# Altium schematic sheet CurrentMeasurement.SchDoc
size A4
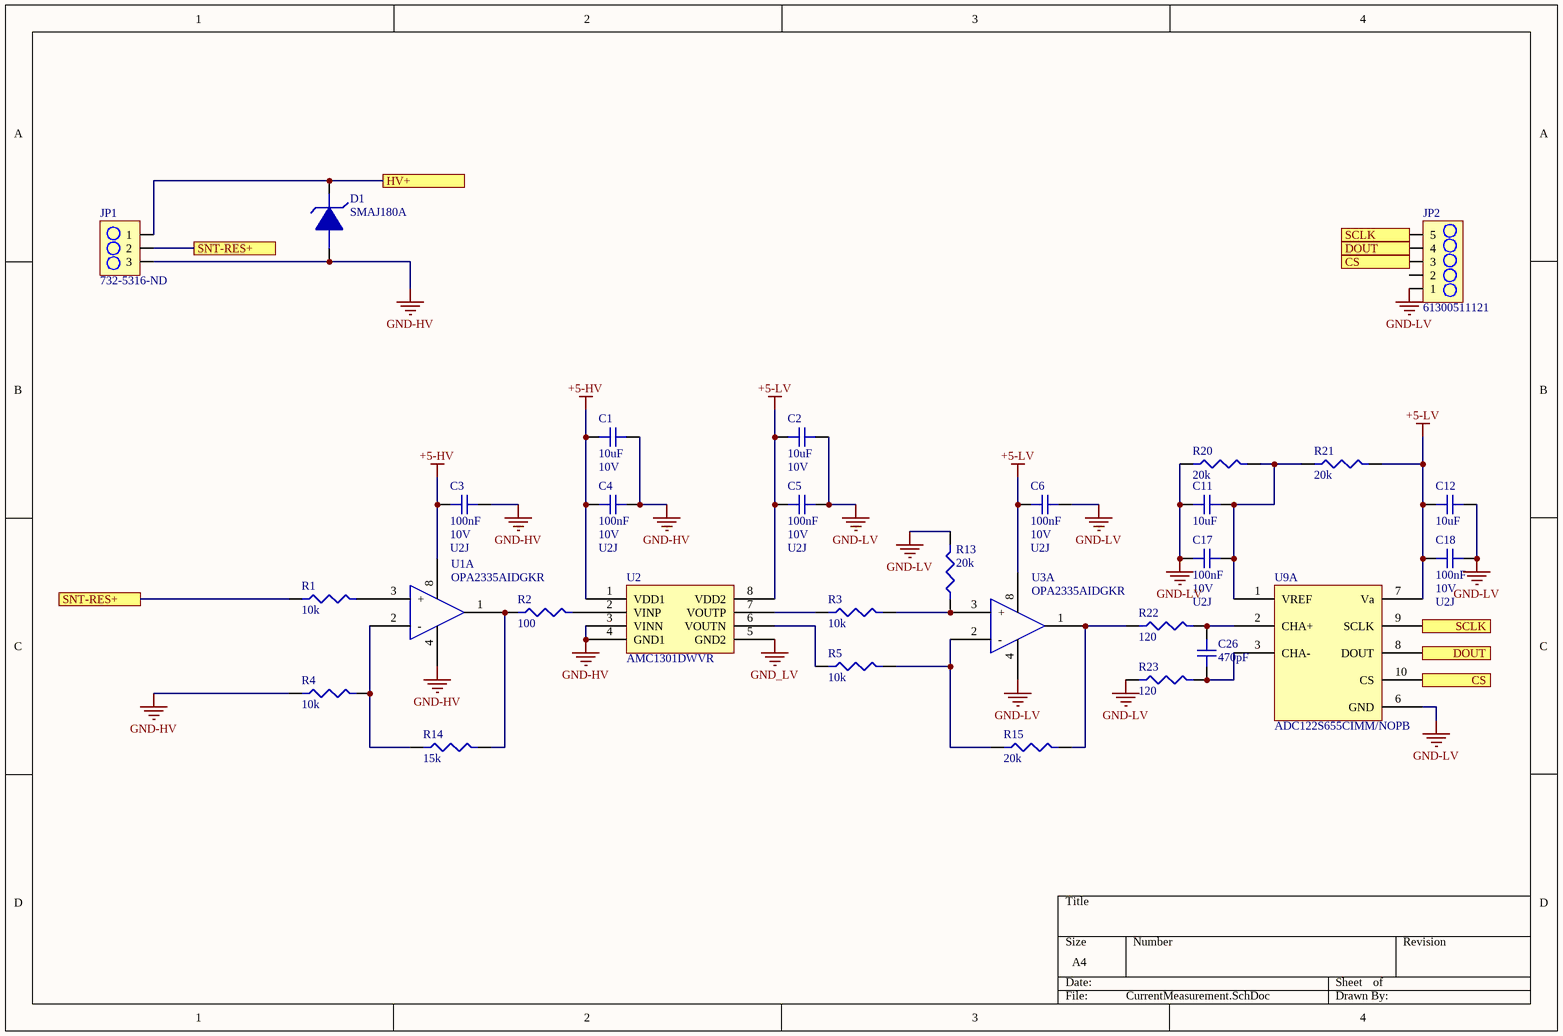
[diagram p0: CurrentMeasurement.SchDoc]

## Parts
C1  10uF  Voltage Rating: 10V  [TANT_10u]
C2  10uF  Voltage Rating: 10V  [TANT_10u]
C3  100nF  Voltage Rating: 10V  Dielectric: U2J  [C0805]
C4  100nF  Voltage Rating: 10V  Dielectric: U2J  [C0805]
C5  100nF  Voltage Rating: 10V  Dielectric: U2J  [C0805]
C6  100nF  Voltage Rating: 10V  Dielectric: U2J  [C0805]
C11  10uF  [C1206]
C12  10uF  [C1206]
C17  100nF  Voltage Rating: 10V  Dielectric: U2J  [C0805]
C18  100nF  Voltage Rating: 10V  Dielectric: U2J  [C0805]
C26  470pF  [C0805]
D1  SMAJ180A  [DIODE_TVS]
JP1  732-5316-ND  [3PIN_HEADER]
JP2  61300511121  [5PIN_HEADER]
R1  10k  [R0805]
R2  100  [R0805]
R3  10k  [R0805]
R4  10k  [R0805]
R5  10k  [R0805]
R13  20k  [R0805]
R14  15k  [R0805]
R15  20k  [R0805]
R20  20k  [R0805]
R21  20k  [R0805]
R22  120  [R0805]
R23  120  [R0805]
U1  OPA2335AIDGKR  [8-VSSOP-OPA2335AIDGKR]  (part A of 2)
U2  AMC1301DWVR  [8-SOIC-AMC1301DWVR]
U3  OPA2335AIDGKR  [8-VSSOP-OPA2335AIDGKR]  (part A of 2)
U9  ADC122S655CIMM/NOPB  [10-VSSOP-ADC122S655CIMM/NOPB]  (part A of 2)

## Ports
CS, DOUT, HV+, SCLK, SNT-RES+

## Nets
+5-HV: C1.1 C3.1 C4.1 U1.8(V+) U2.1(VDD1)
+5-LV: C2.1 C5.1 C6.1 C12.1 C18.1 R21.2 U2.8(VDD2) U3.8(V+) U9.7(Va)
GND-HV: C1.2 C3.2 C4.2 D1.2 JP1.3 R4.1 U1.4(V-) U2.3(VINN) U2.4(GND1)
GND-LV: C2.2 C5.2 C6.2 C11.1 C12.2 C17.1 C18.2 JP2.1 R13.2 R20.1 R23.1 U3.4(V-) U9.6(GND)
GND_LV: U2.5(GND2)
CS: JP2.3 U9.10(CS) ; port CS
DOUT: JP2.4 U9.8(DOUT) ; port DOUT
HV+: D1.1 JP1.1 ; port HV+
SCLK: JP2.5 U9.9(SCLK) ; port SCLK
SNT-RES+: JP1.2 R1.1 ; port SNT-RES+
NetC11_2: C11.2 C17.2 R20.2 R21.1 U9.1(VREF)
NetC26_1: C26.1 R23.2 U9.3(CHA-)
NetC26_2: C26.2 R22.2 U9.2(CHA+)
NetR1_2: R1.2 U1.3(+)
NetR2_1: R2.1 R14.2 U1.1(OutA)
NetR2_2: R2.2 U2.2(VINP)
NetR3_1: R3.1 U2.7(VOUTP)
NetR3_2: R3.2 R13.1 U3.3(+)
NetR4_2: R4.2 R14.1 U1.2(-)
NetR5_1: R5.1 U2.6(VOUTN)
NetR5_2: R5.2 R15.1 U3.2(-)
NetR15_2: R15.2 R22.1 U3.1(OutA)

Not connected (* = marked no-connect by the designer): JP2 2

## Library data of the parts
C1 C2 = F381A106MMA: CAP TANTALUM 10uF, 0603 [1608 Metric], 0.5 ohm, 10 V AVX  Surface Mount Tantalum Capacitor, F38 Series, 10uF, 0603 [1608 Metric], 0.5 ohm, 10 V; Manufacturer: Kyocera AVX; Tolerance: 20%; ESR (Equivalent Series Resistance): 500mR; Life (Hours): 1000Hour; Dissipation Factor: 15%; Leakage Current: 10uA; Supplier 1: Digi-Key; Manufacturer Part Number: F381A106MMA; Stock 1: 7989; Pricing 1: 1=0.75, 10=0.551, 100=0.3779, 500=0.2992, 1000=0.2519 (USD); Case/Package: 0603; Weight: 7.1E-05oz; Case Code (Metric): 1608; Case Code (Imperial): 0603; Min Operating Temperature: -55°C; Max Operating Temperature: 105°C; Capacitance: 10uF; Packaging: Tape and Reel; Termination: SMD/SMT; Package Quantity: 4000; Voltage Rating (DC): 10V; Length: 1.6mm; Height: 0.8mm; Width: 0.033inch; Height - Seated (Max): 0.035inch; Depth: 0.85mm; Radiation Hardening: No; REACH SVHC: No SVHC; ComponentLink1URL: https://datasheet.ciiva.com/48510/f38-48510901.pdf; ComponentLink1Description: https://datasheet.ciiva.com/48510/f38-48510901.pdf; ComponentLink2URL: https://datasheet.ciiva.com/46417/1805432-46417517.pdf; ComponentLink2Description: https://datasheet.ciiva.com/46417/1805432-46417517.pdf; ComponentLink3URL: https://datasheet.ciiva.com/46417/1805432-46417518.pdf; ComponentLink3Description: https://datasheet.ciiva.com/46417/1805432-46417518.pdf; Supplier Part Number 1: 478-9527-1-ND
C3-C6 C17 C18 = GRM21B7U1A104JA01L: CAP MLCC 100nF 10Volts U2J 5%; Manufacturer: Murata; Supplier 1: Digi-Key; Manufacturer Part Number: GRM21B7U1A104JA01L; Stock 1: 6000; Pricing 1: 1=0.46, 10=0.32, 100=0.192, 500=0.144, 1000=0.1216 (USD); Mount: Surface Mount; Case/Package: 0805; Case Code (Imperial): 0805; Case Code (Metric): 2012; Min Operating Temperature: -55°C; Max Operating Temperature: 125°C; Capacitance: 100nF; Voltage Rating (DC): 10V; Tolerance: 5%; Packaging: Tape and Reel; Package Quantity: 3000; Termination: SMD/SMT; Length: 2mm; Height: 1.25mm; Width: 0.049inch; Thickness: 0.053inch; Depth: 1.25mm; Radiation Hardening: No; ComponentLink1URL: https://datasheet.ciiva.com/5424/product-5424660.pdf; ComponentLink1Description: https://datasheet.ciiva.com/5424/product-5424660.pdf; ComponentLink2URL: https://datasheet.ciiva.com/17451/product-17451845.pdf; ComponentLink2Description: https://datasheet.ciiva.com/17451/product-17451845.pdf; ComponentLink3URL: https://datasheet.ciiva.com/11618/product-11618924.pdf; ComponentLink3Description: https://datasheet.ciiva.com/11618/product-11618924.pdf; Supplier Part Number 1: 490-11592-6-ND
C11 C12 = GCJ31CR71A106KA13L: CAP 10µF ±10% 10V Ceramic Capacitor X7R 1206 (3216 Metric); Manufacturer: Murata; Manufacturer Part Number: GCJ31CR71A106KA13L; Mount: Surface Mount; Case/Package: 1206; Case Code (Metric): 3216; Min Operating Temperature: -55°C; Max Operating Temperature: 125°C; Capacitance: 10uF; Tolerance: 10%; Packaging: Tape and Reel; Package Quantity: 2000; Length: 3.2mm; Height: 1.8mm; Width: 0.063 inch; Thickness: 0.071 inch; Radiation Hardening: No; Voltage Rating: 10V; Supplier 1: Digi-Key; ComponentLink1Description: https://www.murata.com/~/media/webrenewal/support/library/catalog/products/capacitor/mlcc/c03e.ashx?la=en-us; ComponentLink1URL: https://www.murata.com/~/media/webrenewal/support/library/catalog/products/capacitor/mlcc/c03e.ashx?la=en-us; Supplier Part Number 1: 490-5848-2-ND
C26 = GRM21A7U2E471JW31D: CAP  470pF ±5% 250V Ceramic Capacitor U2J 0805 (2012 Metric); Manufacturer: Murata; Manufacturer Part Number: GRM21A7U2E471JW31D; Mount: Surface Mount; Case/Package: 0805; Case Code (Metric): 2012; Min Operating Temperature: -55°C; Max Operating Temperature: 125°C; Capacitance: 470pF; Tolerance: 5%; Packaging: Tape and Reel; Package Quantity: 2000; Length: 2mm; Height: 1.25mm; Width: 0.063 inch; Thickness: 0.071 inch; Radiation Hardening: No; Voltage Rating: 250V; Supplier 1: Digi-Key; Supplier Part Number 1: 490-6460-2-ND
D1 = SMAJ180A: TVS diode 180V, 292V Clamp 1.4A Ipp Tvs Diode Surface Mount DO-214AC (SMA); Manufacturer: MCC; Voltage - Reverse standoff: 180; Type: Zener; Power peak pulse: 400W; Voltage breakdown: 201V; Manufacturer Part Number: SMAJ180A; Mount: Surface Mount; Current peak Pulse: 1.4A; Packaging: Tape and Reel; Voltage Clamping: 292V; Lead Free: Lead Free; Supplier 1: Digi-Key; ComponentLink1Description: https://www.littelfuse.com/~/media/electronics/datasheets/tvs_diodes/littelfuse_tvs_diode_smaj_datasheet.pdf.pdf; ComponentLink1URL: https://www.littelfuse.com/~/media/electronics/datasheets/tvs_diodes/littelfuse_tvs_diode_smaj_datasheet.pdf.pdf; Supplier Part Number 1: SMAJ180ALFTR-ND
JP1 = 61300311121: CONN_HeaderPins3pos WURTH ELEKTRONIK Board-To-Board Connector, Vertical, WR-PHD Series, Through Hole, Header, 3 Contacts, 2.54 mm; Manufacturer: Wurth Electronics; Number of Positions: 3; Gender: Male; Connector Type: Male Pin; Pitch: 0.1inch; Supplier 1: Digi-Key; Manufacturer Part Number: 61300311121; Stock 1: 57026; Pricing 1: 1=0.13, 10=0.106, 25=0.088, 50=0.074, 100=0.067, 1000=0.061 (USD); Mount: Through Hole; Case/Package: 100; Contact Plating: Gold; Contact Material: Copper; Colour: Black; Number of Rows: 1; Packaging: Bulk; Termination: Solder; Number of Contacts: 3; Contact Mating Length: 0.236inch; REACH SVHC: Unknown; Lead Free: Lead Free; ComponentLink1URL: http://www.farnell.com/cad/1737268.pdf; ComponentLink1Description: http://www.farnell.com/cad/1737268.pdf; Supplier Part Number 1: 732-5316-ND
JP2 = 61300511121: CONN_HeaderPins5pos WURTH ELEKTRONIK         61300511121            Board-To-Board Connector, Vertical, WR-PHD Series, Through Hole, Header, 5 Contacts, 2.54 mm; Manufacturer: Wurth Electronics; Number of Positions: 5; Gender: Male; Connector Type: Male Pin; Pitch: 0.1inch; Supplier 1: Digi-Key; Manufacturer Part Number: 61300511121; Stock 1: 13004; Pricing 1: 1=0.25, 10=0.209, 25=0.174, 50=0.145, 100=0.132, 1000=0.12 (USD); Mount: Through Hole; Contact Plating: Gold; Contact Material: Copper; Colour: Black; Number of Rows: 1; Packaging: Bulk; Termination: Solder; Number of Contacts: 5; Contact Mating Length: 0.236inch; REACH SVHC: Unknown; Lead Free: Lead Free; ComponentLink1URL: http://www.farnell.com/cad/1737268.pdf; ComponentLink1Description: http://www.farnell.com/cad/1737268.pdf; Supplier Part Number 1: 732-5318-ND
R1 R3-R5 = RC0805FR-071KL: RES SMD 10K OHM 1% 1/8W 0805; Manufacturer: Yageo Phycomp; Temperature Coefficient: 100ppm/°C; Resistance: 1KR; Voltage Rating (DC): 150V; Power Rating: 125mW; Supplier 1: Digi-Key; Manufacturer Part Number: RC0805FR-071KL; Stock 1: 5527973; Pricing 1: 1=0.1, 10=0.022, 100=0.0088, 1000=0.004, 2500=0.0034 (USD); Case/Package: 0805; Number of Pins: 2; Min Operating Temperature: -55°C; Max Operating Temperature: 155°C; Tolerance: 1%; Packaging: Cut Tape; Length: 2mm; Height: 0.5mm; Width: 1.25mm; Depth: 1.25mm; REACH SVHC: No SVHC; Lead Free: Lead Free
R2 = ERA-6AEB101V: RES SMD 100 OHM 0805 100 Ohm 0.1% 0.125W(1/8W) ±25ppm/C Molded SMD Automotive Punched T/R; Manufacturer: Panasonic ECG; Manufacturer Part Number: ERA-6AEB102V; Voltage Rating: 100V; Resistance: 100R; Power Rating: 125mW; Temperature Coefficient: 25ppm/°C; Mount: Surface Mount; Case/Package: 0805; Number of Pins: 2; Case Code (Metric): 2012; Case Code (Imperial): 0805; Contact Plating: Tin; Min Operating Temperature: -55°C; Max Operating Temperature: 155°C; Packaging: Tape and Reel; Tolerance: 0.1%; Package Quantity: 5000; Composition: Thin Film; Number of Terminations: 2; Military Standard: Not; Termination: SMD/SMT; Max Power Dissipation: 125mW; Length: 2mm; Height: 0.5mm; Width: 1.25mm; Depth: 1.25mm; Radiation Hardening: No; REACH SVHC: No SVHC; ComponentLink1Description: https://industrial.panasonic.com/cdbs/www-data/pdf/RDM0000/AOA0000C307.pdf; ComponentLink1URL: https://industrial.panasonic.com/cdbs/www-data/pdf/RDM0000/AOA0000C307.pdf; Supplier 1: Digi-Key; Supplier Part Number 1: P100DATR-ND
R13 R15 R20 R21 = ERA-6AEB203V: RES SMD 20K OHM 0805 20K Ohm 0.1% 0.125W(1/8W) ±25ppm/C Molded SMD Automotive Punched T/R; Manufacturer: Panasonic ECG; Manufacturer Part Number: ERA-6AEB102V; Voltage Rating: 100V; Resistance: 20kR; Power Rating: 125mW; Temperature Coefficient: 25ppm/°C; Mount: Surface Mount; Case/Package: 0805; Number of Pins: 2; Case Code (Metric): 2012; Case Code (Imperial): 0805; Contact Plating: Tin; Min Operating Temperature: -55°C; Max Operating Temperature: 155°C; Packaging: Tape and Reel; Tolerance: 0.1%; Package Quantity: 5000; Composition: Thin Film; Number of Terminations: 2; Military Standard: Not; Termination: SMD/SMT; Max Power Dissipation: 125mW; Length: 2mm; Height: 0.5mm; Width: 1.25mm; Depth: 1.25mm; Radiation Hardening: No; REACH SVHC: No SVHC; ComponentLink1Description: https://industrial.panasonic.com/cdbs/www-data/pdf/RDM0000/AOA0000C307.pdf; ComponentLink1URL: https://industrial.panasonic.com/cdbs/www-data/pdf/RDM0000/AOA0000C307.pdf; Supplier 1: Digi-Key; Supplier Part Number 1: P20KDATR-ND
R14 = ERA-6AEB153V: RES SMD 15K OHM 0805 15K Ohm 0.1% 0.125W(1/8W) ±25ppm/C Molded SMD Automotive Punched T/R; Manufacturer: Panasonic ECG; Manufacturer Part Number: ERA-6AEB102V; Voltage Rating: 100V; Resistance: 15kR; Power Rating: 125mW; Temperature Coefficient: 25ppm/°C; Mount: Surface Mount; Case/Package: 0805; Number of Pins: 2; Case Code (Metric): 2012; Case Code (Imperial): 0805; Contact Plating: Tin; Min Operating Temperature: -55°C; Max Operating Temperature: 155°C; Packaging: Tape and Reel; Tolerance: 0.1%; Package Quantity: 5000; Composition: Thin Film; Number of Terminations: 2; Military Standard: Not; Termination: SMD/SMT; Max Power Dissipation: 125mW; Length: 2mm; Height: 0.5mm; Width: 1.25mm; Depth: 1.25mm; Radiation Hardening: No; REACH SVHC: No SVHC; Supplier 1: Digi-Key; ComponentLink1Description: https://industrial.panasonic.com/cdbs/www-data/pdf/RDM0000/AOA0000C307.pdf; ComponentLink1URL: https://industrial.panasonic.com/cdbs/www-data/pdf/RDM0000/AOA0000C307.pdf; Supplier Part Number 1: P15KDATR-ND
R22 R23 = RC0805FR-07120RL: RES SMD 120 OHM 1% 1/8W 0805; Manufacturer: Yageo; Resistance: 120R; Power Rating: 125mW; Voltage Rating: 150V; Temperature Coefficient: 100ppm/°C; Supplier 1: Digi-Key; Manufacturer Part Number: RC0805FR-07120RL; Stock 1: 632664; Pricing 1: 1=0.1, 10=0.022, 100=0.0088, 1000=0.004, 2500=0.0034 (USD); Case/Package: 0805; Case Code (Metric): 2012; Case Code (Imperial): 0805; Min Operating Temperature: -55°C; Max Operating Temperature: 155°C; Tolerance: 1%; Package Quantity: 1; Packaging: Tape and Reel; Composition: Thick Film; Number of Terminations: 2; Termination: SMD/SMT; Military Standard: Not; Max Power Dissipation: 125mW; Length: 2mm; Height: 0.5mm; Width: 0.049inch; Depth: 1.25mm; REACH SVHC: Unknown; Lead Free: Lead Free; ComponentLink1URL: https://datasheet.ciiva.com/2491/pyu-r-int-thick-7-2491585.pdf; ComponentLink1Description: https://datasheet.ciiva.com/2491/pyu-r-int-thick-7-2491585.pdf; ComponentLink2URL: https://datasheet.ciiva.com/2491/pyu-r-int-thick-7-2491586.pdf; ComponentLink2Description: https://datasheet.ciiva.com/2491/pyu-r-int-thick-7-2491586.pdf; ComponentLink3URL: https://datasheet.ciiva.com/2491/pyu-r-int-thick-7-2491587.pdf; ComponentLink3Description: https://datasheet.ciiva.com/2491/pyu-r-int-thick-7-2491587.pdf; ComponentLink4URL: https://datasheet.ciiva.com/12558/rc0805-257173-12558661.pdf; ComponentLink4Description: https://datasheet.ciiva.com/12558/rc0805-257173-12558661.pdf; ComponentLink5URL: https://datasheet.ciiva.com/11819/0900766b8106beab-11819786.pdf; ComponentLink5Description: https://datasheet.ciiva.com/11819/0900766b8106beab-11819786.pdf; ComponentLink6URL: https://datasheet.ciiva.com/7941/444164-7941691.pdf; ComponentLink6Description: https://datasheet.ciiva.com/7941/444164-7941691.pdf; ComponentLink7URL: https://datasheet.ciiva.com/7941/444164-7941692.pdf; ComponentLink7Description: https://datasheet.ciiva.com/7941/444164-7941692.pdf; ComponentLink8URL: https://datasheet.ciiva.com/16964/rc0805-16964606.pdf; ComponentLink8Description: https://datasheet.ciiva.com/16964/rc0805-16964606.pdf; Supplier Part Number 1: 311-120CRCT-ND
U1 U3 = OPA2335AIDGKR: IC OPAMP ZERO-DRIFT 2CIRC 8VSSOP; Manufacturer: Texas Instruments; Gain Bandwidth Product: 2MHz; Current - Input Bias: 70 pA; Current - Supply: 570 uA; Current - Output: 50 mA; Voltage Supply: 2.7-5.5V, +/-1.35 - 2.75; Voltage - Input Offset: 1 uV; Slew Rate: 1.6V/us; Output Type: Rail-to-Rail; Manufacturer Part Number: OPA2335AIDGKR; Case/Package: 8-TSSOP; Amplifier Type: Zero-Drift; Operating Temperature: -40C - 125C; Mounting: Surface Mount; ComponentLink1Description: http://www.ti.com/general/docs/suppproductinfo.tsp?distId=10&gotoUrl=http%3A%2F%2Fwww.ti.com%2Flit%2Fgpn%2Fopa334; ComponentLink1URL: http://www.ti.com/general/docs/suppproductinfo.tsp?distId=10&gotoUrl=http%3A%2F%2Fwww.ti.com%2Flit%2Fgpn%2Fopa334; Supplier 1: Digi-Key; Supplier Part Number 1: 296-41350-1-ND
U2 = AMC1301DWVR: IC OPAMP ISOLATION 1 CIRC 8 SOIC; Manufacturer: Texas Instruments; Gain Bandwidth Product: 1MHz; Current - Input Bias: 60 uA; Current - Supply: 5.9 mA; Current - Output: 13 mA; Voltage Supply: 3v - 5.5V; Voltage - Input Offset: 50 uV; Manufacturer Part Number: AMC1301DWVR; Case/Package: 8-SOIC; ComponentLink1Description: http://www.ti.com/general/docs/suppproductinfo.tsp?distId=10&gotoUrl=http%3A%2F%2Fwww.ti.com%2Flit%2Fgpn%2Famc1301; ComponentLink1URL: http://www.ti.com/general/docs/suppproductinfo.tsp?distId=10&gotoUrl=http%3A%2F%2Fwww.ti.com%2Flit%2Fgpn%2Famc1301; Supplier 1: Digi-Key; Supplier Part Number 1: 296-44577-1-ND; Amplifier Type: Isolation; Operating Temperature: -40C - 125C; Mounting: Surface Mount
U9 = ADC122S655CIMM/NOPB: 12 Bit Analog to Digital Converter 2 Input 2 SAR 10-VSSOP; Manufacturer: Texas Instruments; Sampleing Rate: 500k; Ratio: 1:1; Number of Inputs: 2; Configuration: S/H-ADC; Number of Bits: 12; Data Interface: SPI, DSP; Input type: Differential, Single Ended; Operation temp: -40C-105C; Voltage Supply Digital: 5V; Reference Type: External; Manufacturer Part Number: ADC122S655CIMM/NOPB; Number of A/D Converters: 2; Architecture: SAR; Mounting: Surface Mount; Package: 10-VSSOP; ComponentLink1Description: http://www.ti.com/general/docs/suppproductinfo.tsp?distId=10&gotoUrl=http%3A%2F%2Fwww.ti.com%2Flit%2Fgpn%2Fadc122s655; ComponentLink1URL: http://www.ti.com/general/docs/suppproductinfo.tsp?distId=10&gotoUrl=http%3A%2F%2Fwww.ti.com%2Flit%2Fgpn%2Fadc122s655; Supplier 1: Digi-Key; Supplier Part Number 1: 296-41405-1-ND; Features: Simultaneous sampling; Voltage Supply Analog: 5V